# Altium project isolated-gate-driver.PrjPcb
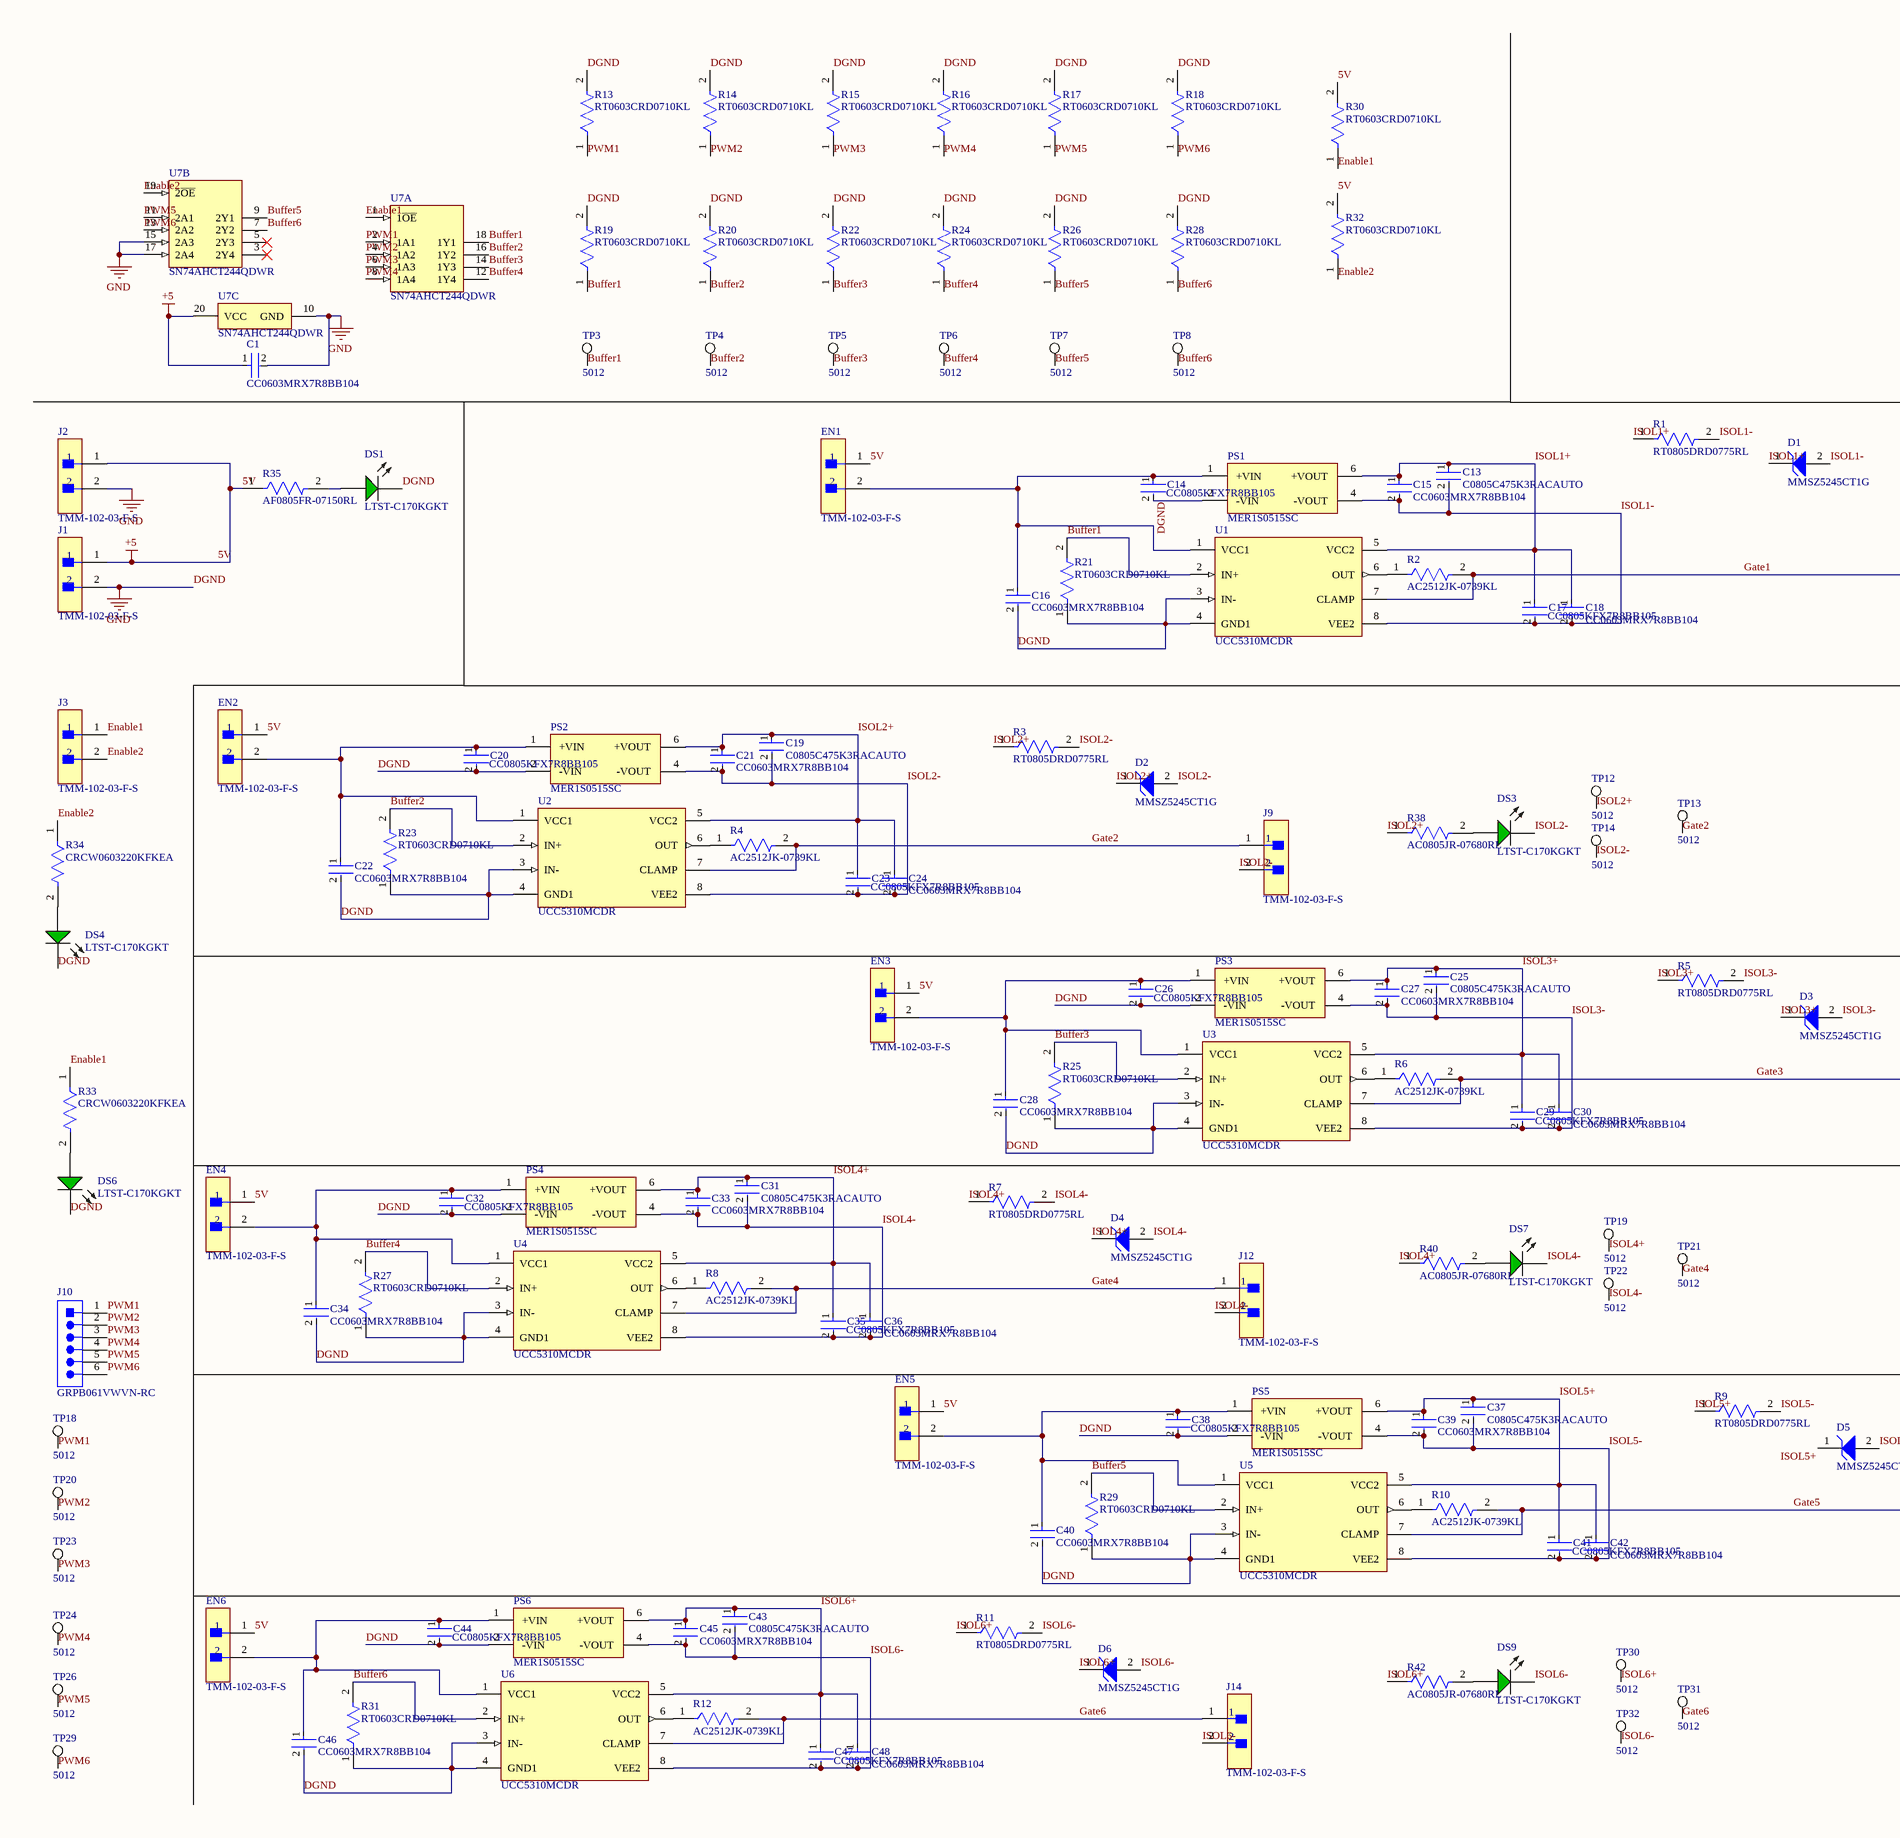
[diagram p0: Sheet2.SchDoc, left]
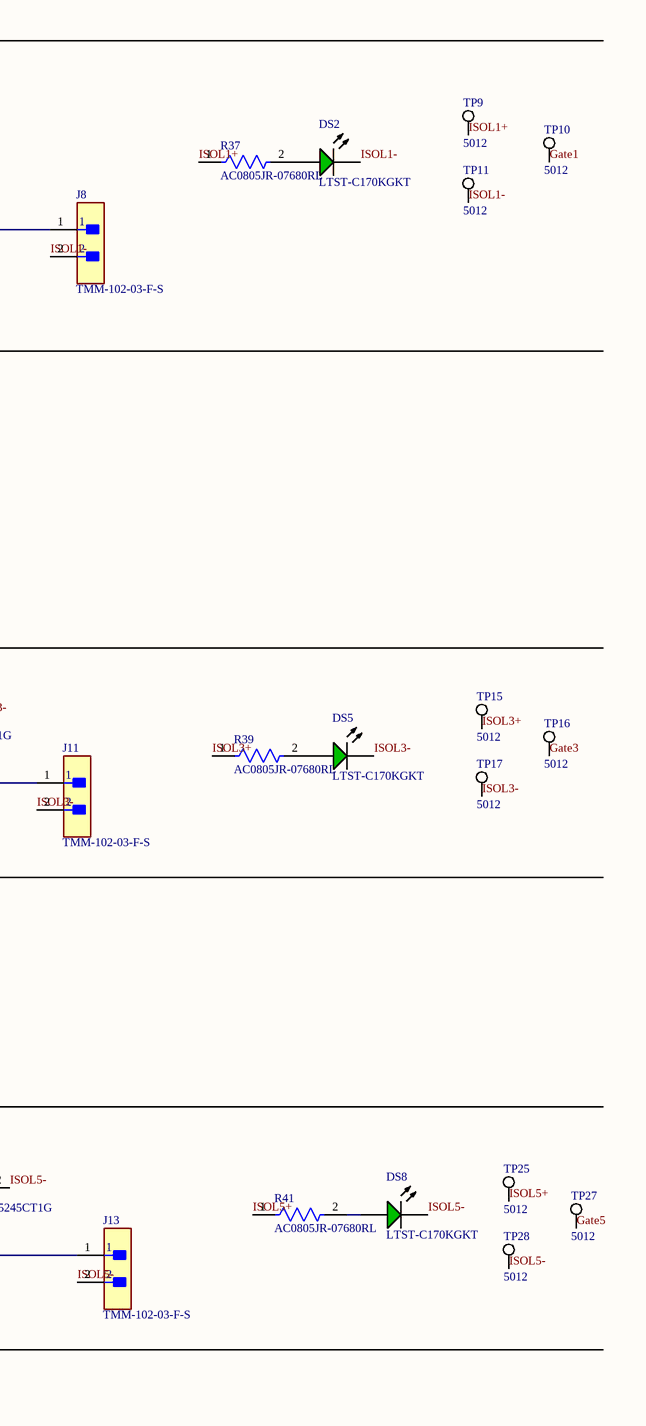
[diagram p1: Sheet2.SchDoc, right]
1 sheet, 152 parts. Net scope: global (net labels, ports and power ports of the same name join across sheets).
Board file: PCB2.PcbDoc

## Sheet Sheet2.SchDoc
size C; SheetNumber: 1; SheetTotal: 1

### Parts
C1  CC0603MRX7R8BB104  [FP-CC0603-DA-MFG]
C13  C0805C475K3RACAUTO  [FP-C0805C475K3RACAUTO-MFG]
C14  CC0805KFX7R8BB105  [FP-CC0805-0_85-MFG]
C15  CC0603MRX7R8BB104  [FP-CC0603-DA-MFG]
C16  CC0603MRX7R8BB104  [FP-CC0603-DA-MFG]
C17  CC0805KFX7R8BB105  [FP-CC0805-0_85-MFG]
C18  CC0603MRX7R8BB104  [FP-CC0603-DA-MFG]
C19  C0805C475K3RACAUTO  [FP-C0805C475K3RACAUTO-MFG]
C20  CC0805KFX7R8BB105  [FP-CC0805-0_85-MFG]
C21  CC0603MRX7R8BB104  [FP-CC0603-DA-MFG]
C22  CC0603MRX7R8BB104  [FP-CC0603-DA-MFG]
C23  CC0805KFX7R8BB105  [FP-CC0805-0_85-MFG]
C24  CC0603MRX7R8BB104  [FP-CC0603-DA-MFG]
C25  C0805C475K3RACAUTO  [FP-C0805C475K3RACAUTO-MFG]
C26  CC0805KFX7R8BB105  [FP-CC0805-0_85-MFG]
C27  CC0603MRX7R8BB104  [FP-CC0603-DA-MFG]
C28  CC0603MRX7R8BB104  [FP-CC0603-DA-MFG]
C29  CC0805KFX7R8BB105  [FP-CC0805-0_85-MFG]
C30  CC0603MRX7R8BB104  [FP-CC0603-DA-MFG]
C31  C0805C475K3RACAUTO  [FP-C0805C475K3RACAUTO-MFG]
C32  CC0805KFX7R8BB105  [FP-CC0805-0_85-MFG]
C33  CC0603MRX7R8BB104  [FP-CC0603-DA-MFG]
C34  CC0603MRX7R8BB104  [FP-CC0603-DA-MFG]
C35  CC0805KFX7R8BB105  [FP-CC0805-0_85-MFG]
C36  CC0603MRX7R8BB104  [FP-CC0603-DA-MFG]
C37  C0805C475K3RACAUTO  [FP-C0805C475K3RACAUTO-MFG]
C38  CC0805KFX7R8BB105  [FP-CC0805-0_85-MFG]
C39  CC0603MRX7R8BB104  [FP-CC0603-DA-MFG]
C40  CC0603MRX7R8BB104  [FP-CC0603-DA-MFG]
C41  CC0805KFX7R8BB105  [FP-CC0805-0_85-MFG]
C42  CC0603MRX7R8BB104  [FP-CC0603-DA-MFG]
C43  C0805C475K3RACAUTO  [FP-C0805C475K3RACAUTO-MFG]
C44  CC0805KFX7R8BB105  [FP-CC0805-0_85-MFG]
C45  CC0603MRX7R8BB104  [FP-CC0603-DA-MFG]
C46  CC0603MRX7R8BB104  [FP-CC0603-DA-MFG]
C47  CC0805KFX7R8BB105  [FP-CC0805-0_85-MFG]
C48  CC0603MRX7R8BB104  [FP-CC0603-DA-MFG]
D1  MMSZ5245CT1G  [ONSC-SOD-123-2-425-04_V]
D2  MMSZ5245CT1G  [ONSC-SOD-123-2-425-04_V]
D3  MMSZ5245CT1G  [ONSC-SOD-123-2-425-04_V]
D4  MMSZ5245CT1G  [ONSC-SOD-123-2-425-04_V]
D5  MMSZ5245CT1G  [ONSC-SOD-123-2-425-04_V]
D6  MMSZ5245CT1G  [ONSC-SOD-123-2-425-04_V]
DS1  LTST-C170KGKT  [LTST-LTST-C170KGKT-2_V]
DS2  LTST-C170KGKT  [LTST-LTST-C170KGKT-2_V]
DS3  LTST-C170KGKT  [LTST-LTST-C170KGKT-2_V]
DS4  LTST-C170KGKT  [LTST-LTST-C170KGKT-2_V]
DS5  LTST-C170KGKT  [LTST-LTST-C170KGKT-2_V]
DS6  LTST-C170KGKT  [LTST-LTST-C170KGKT-2_V]
DS7  LTST-C170KGKT  [LTST-LTST-C170KGKT-2_V]
DS8  LTST-C170KGKT  [LTST-LTST-C170KGKT-2_V]
DS9  LTST-C170KGKT  [LTST-LTST-C170KGKT-2_V]
EN1  TMM-102-03-F-S  [PinHeader_1x02_P2.54mm_Vertical]
EN2  TMM-102-03-F-S  [PinHeader_1x02_P2.54mm_Vertical]
EN3  TMM-102-03-F-S  [PinHeader_1x02_P2.54mm_Vertical]
EN4  TMM-102-03-F-S  [PinHeader_1x02_P2.54mm_Vertical]
EN5  TMM-102-03-F-S  [PinHeader_1x02_P2.54mm_Vertical]
EN6  TMM-102-03-F-S  [PinHeader_1x02_P2.54mm_Vertical]
J1  TMM-102-03-F-S  [PinHeader_1x02_P2.54mm_Vertical]
J2  TMM-102-03-F-S  [PinHeader_1x02_P2.54mm_Vertical]
J3  TMM-102-03-F-S  [PinHeader_1x02_P2.54mm_Vertical]
J8  TMM-102-03-F-S  [PinHeader_1x02_P2.54mm_Vertical]
J9  TMM-102-03-F-S  [PinHeader_1x02_P2.54mm_Vertical]
J10  GRPB061VWVN-RC  [PinHeader_1x06_P2.54mm_Vertical]
J11  TMM-102-03-F-S  [PinHeader_1x02_P2.54mm_Vertical]
J12  TMM-102-03-F-S  [PinHeader_1x02_P2.54mm_Vertical]
J13  TMM-102-03-F-S  [PinHeader_1x02_P2.54mm_Vertical]
J14  TMM-102-03-F-S  [PinHeader_1x02_P2.54mm_Vertical]
PS1  MER1S0515SC  [MER1S0515SC_MFG]
PS2  MER1S0515SC  [MER1S0515SC_MFG]
PS3  MER1S0515SC  [MER1S0515SC_MFG]
PS4  MER1S0515SC  [MER1S0515SC_MFG]
PS5  MER1S0515SC  [MER1S0515SC_MFG]
PS6  MER1S0515SC  [MER1S0515SC_MFG]
R1  RT0805DRD0775RL  [FP-RT0805-MFG]
R2  AC2512JK-0739KL  [FP-AC2512-MFG]
R3  RT0805DRD0775RL  [FP-RT0805-MFG]
R4  AC2512JK-0739KL  [FP-AC2512-MFG]
R5  RT0805DRD0775RL  [FP-RT0805-MFG]
R6  AC2512JK-0739KL  [FP-AC2512-MFG]
R7  RT0805DRD0775RL  [FP-RT0805-MFG]
R8  AC2512JK-0739KL  [FP-AC2512-MFG]
R9  RT0805DRD0775RL  [FP-RT0805-MFG]
R10  AC2512JK-0739KL  [FP-AC2512-MFG]
R11  RT0805DRD0775RL  [FP-RT0805-MFG]
R12  AC2512JK-0739KL  [FP-AC2512-MFG]
R13  RT0603CRD0710KL  [FP-RT0603-MFG]
R14  RT0603CRD0710KL  [FP-RT0603-MFG]
R15  RT0603CRD0710KL  [FP-RT0603-MFG]
R16  RT0603CRD0710KL  [FP-RT0603-MFG]
R17  RT0603CRD0710KL  [FP-RT0603-MFG]
R18  RT0603CRD0710KL  [FP-RT0603-MFG]
R19  RT0603CRD0710KL  [FP-RT0603-MFG]
R20  RT0603CRD0710KL  [FP-RT0603-MFG]
R21  RT0603CRD0710KL  [FP-RT0603-MFG]
R22  RT0603CRD0710KL  [FP-RT0603-MFG]
R23  RT0603CRD0710KL  [FP-RT0603-MFG]
R24  RT0603CRD0710KL  [FP-RT0603-MFG]
R25  RT0603CRD0710KL  [FP-RT0603-MFG]
R26  RT0603CRD0710KL  [FP-RT0603-MFG]
R27  RT0603CRD0710KL  [FP-RT0603-MFG]
R28  RT0603CRD0710KL  [FP-RT0603-MFG]
R29  RT0603CRD0710KL  [FP-RT0603-MFG]
R30  RT0603CRD0710KL  [FP-RT0603-MFG]
R31  RT0603CRD0710KL  [FP-RT0603-MFG]
R32  RT0603CRD0710KL  [FP-RT0603-MFG]
R33  CRCW0603220KFKEA  [FP-CRCW0603-e3-IPC_B]
R34  CRCW0603220KFKEA  [FP-CRCW0603-e3-IPC_B]
R35  AF0805FR-07150RL  [FP-AF0805-MFG]
R37  AC0805JR-07680RL  [FP-AC0805-MFG]
R38  AC0805JR-07680RL  [FP-AC0805-MFG]
R39  AC0805JR-07680RL  [FP-AC0805-MFG]
R40  AC0805JR-07680RL  [FP-AC0805-MFG]
R41  AC0805JR-07680RL  [FP-AC0805-MFG]
R42  AC0805JR-07680RL  [FP-AC0805-MFG]
TP3  5012  [KSTN-5012_V]
TP4  5012  [KSTN-5012_V]
TP5  5012  [KSTN-5012_V]
TP6  5012  [KSTN-5012_V]
TP7  5012  [KSTN-5012_V]
TP8  5012  [KSTN-5012_V]
TP9  5012  [KSTN-5012_V]
TP10  5012  [KSTN-5012_V]
TP11  5012  [KSTN-5012_V]
TP12  5012  [KSTN-5012_V]
TP13  5012  [KSTN-5012_V]
TP14  5012  [KSTN-5012_V]
TP15  5012  [KSTN-5012_V]
TP16  5012  [KSTN-5012_V]
TP17  5012  [KSTN-5012_V]
TP18  5012  [KSTN-5012_V]
TP19  5012  [KSTN-5012_V]
TP20  5012  [KSTN-5012_V]
TP21  5012  [KSTN-5012_V]
TP22  5012  [KSTN-5012_V]
TP23  5012  [KSTN-5012_V]
TP24  5012  [KSTN-5012_V]
TP25  5012  [KSTN-5012_V]
TP26  5012  [KSTN-5012_V]
TP27  5012  [KSTN-5012_V]
TP28  5012  [KSTN-5012_V]
TP29  5012  [KSTN-5012_V]
TP30  5012  [KSTN-5012_V]
TP31  5012  [KSTN-5012_V]
TP32  5012  [KSTN-5012_V]
U1  UCC5310MCDR  [FP-D0008B-MFG]
U2  UCC5310MCDR  [FP-D0008B-MFG]
U3  UCC5310MCDR  [FP-D0008B-MFG]
U4  UCC5310MCDR  [FP-D0008B-MFG]
U5  UCC5310MCDR  [FP-D0008B-MFG]
U6  UCC5310MCDR  [FP-D0008B-MFG]
U7  SN74AHCT244QDWR  [DW0020A_M]  (parts A,B,C of 3)

### Nets
5V: C1.1 EN1.1 EN2.1 EN3.1 EN4.1 EN5.1 EN6.1 J1.1 J2.1 R30.2 R32.2 R35.1 U7.20(VCC)  [also labelled +5]
DGND: C1.2 C14.2 C16.2 C20.2 C22.2 C26.2 C28.2 C32.2 C34.2 C38.2 C40.2 C44.2 C46.2 DS1.1(K) DS4.1(K) DS6.1(K) J1.2 J2.2 PS1.2(-VIN) PS2.2(-VIN) PS3.2(-VIN) PS4.2(-VIN) PS5.2(-VIN) PS6.2(-VIN) R13.2 R14.2 R15.2 R16.2 R17.2 R18.2 R19.2 R20.2 R21.1 R22.2 R23.1 R24.2 R25.1 R26.2 R27.1 R28.2 R29.1 R31.1 U1.3(IN-) U1.4(GND1) U2.3(IN-) U2.4(GND1) U3.3(IN-) U3.4(GND1) U4.3(IN-) U4.4(GND1) U5.3(IN-) U5.4(GND1) U6.3(IN-) U6.4(GND1) U7.10(GND) U7.15(2A3) U7.17(2A4)  [also labelled GND]
Buffer1: R19.1 R21.2 TP3.1 U1.2(IN+) U7.18(1Y1)
Buffer2: R20.1 R23.2 TP4.1 U2.2(IN+) U7.16(1Y2)
Buffer3: R22.1 R25.2 TP5.1 U3.2(IN+) U7.14(1Y3)
Buffer4: R24.1 R27.2 TP6.1 U4.2(IN+) U7.12(1Y4)
Buffer5: R26.1 R29.2 TP7.1 U5.2(IN+) U7.9(2Y1)
Buffer6: R28.1 R31.2 TP8.1 U6.2(IN+) U7.7(2Y2)
Enable1: J3.1 R30.1 R33.1 U7.1(1~{OE})
Enable2: J3.2 R32.1 R34.1 U7.19(2~{OE})
Gate1: J8.1 R2.2 TP10.1 U1.7(CLAMP)
Gate2: J9.1 R4.2 TP13.1 U2.7(CLAMP)
Gate3: J11.1 R6.2 TP16.1 U3.7(CLAMP)
Gate4: J12.1 R8.2 TP21.1 U4.7(CLAMP)
Gate5: J13.1 R10.2 TP27.1 U5.7(CLAMP)
Gate6: J14.1 R12.2 TP31.1 U6.7(CLAMP)
ISOL1+: C13.1 C15.1 C17.1 C18.1 D1.1(K) PS1.6(+VOUT) R1.1 R37.1 TP9.1 U1.5(VCC2)
ISOL1-: C13.2 C15.2 C17.2 C18.2 D1.2(A) DS2.1(K) J8.2 PS1.4(-VOUT) R1.2 TP11.1 U1.8(VEE2)
ISOL2+: C19.1 C21.1 C23.1 C24.1 D2.1(K) PS2.6(+VOUT) R3.1 R38.1 TP12.1 U2.5(VCC2)
ISOL2-: C19.2 C21.2 C23.2 C24.2 D2.2(A) DS3.1(K) J9.2 PS2.4(-VOUT) R3.2 TP14.1 U2.8(VEE2)
ISOL3+: C25.1 C27.1 C29.1 C30.1 D3.1(K) PS3.6(+VOUT) R5.1 R39.1 TP15.1 U3.5(VCC2)
ISOL3-: C25.2 C27.2 C29.2 C30.2 D3.2(A) DS5.1(K) J11.2 PS3.4(-VOUT) R5.2 TP17.1 U3.8(VEE2)
ISOL4+: C31.1 C33.1 C35.1 C36.1 D4.1(K) PS4.6(+VOUT) R7.1 R40.1 TP19.1 U4.5(VCC2)
ISOL4-: C31.2 C33.2 C35.2 C36.2 D4.2(A) DS7.1(K) J12.2 PS4.4(-VOUT) R7.2 TP22.1 U4.8(VEE2)
ISOL5+: C37.1 C39.1 C41.1 C42.1 D5.1(K) PS5.6(+VOUT) R9.1 R41.1 TP25.1 U5.5(VCC2)
ISOL5-: C37.2 C39.2 C41.2 C42.2 D5.2(A) DS8.1(K) J13.2 PS5.4(-VOUT) R9.2 TP28.1 U5.8(VEE2)
ISOL6+: C43.1 C45.1 C47.1 C48.1 D6.1(K) PS6.6(+VOUT) R11.1 R42.1 TP30.1 U6.5(VCC2)
ISOL6-: C43.2 C45.2 C47.2 C48.2 D6.2(A) DS9.1(K) J14.2 PS6.4(-VOUT) R11.2 TP32.1 U6.8(VEE2)
PWM1: J10.1 R13.1 TP18.1 U7.2(1A1)
PWM2: J10.2 R14.1 TP20.1 U7.4(1A2)
PWM3: J10.3 R15.1 TP23.1 U7.6(1A3)
PWM4: J10.4 R16.1 TP24.1 U7.8(1A4)
PWM5: J10.5 R17.1 TP26.1 U7.11(2A1)
PWM6: J10.6 R18.1 TP29.1 U7.13(2A2)
NetC14_1: C14.1 C16.1 EN1.2 PS1.1(+VIN) U1.1(VCC1)
NetC20_1: C20.1 C22.1 EN2.2 PS2.1(+VIN) U2.1(VCC1)
NetC26_1: C26.1 C28.1 EN3.2 PS3.1(+VIN) U3.1(VCC1)
NetC32_1: C32.1 C34.1 EN4.2 PS4.1(+VIN) U4.1(VCC1)
NetC38_1: C38.1 C40.1 EN5.2 PS5.1(+VIN) U5.1(VCC1)
NetC44_1: C44.1 C46.1 EN6.2 PS6.1(+VIN) U6.1(VCC1)
NetDS1_2: DS1.2(A) R35.2
NetDS2_2: DS2.2(A) R37.2
NetDS3_2: DS3.2(A) R38.2
NetDS4_2: DS4.2(A) R34.2
NetDS5_2: DS5.2(A) R39.2
NetDS6_2: DS6.2(A) R33.2
NetDS7_2: DS7.2(A) R40.2
NetDS8_2: DS8.2(A) R41.2
NetDS9_2: DS9.2(A) R42.2
NetR2_1: R2.1 U1.6(OUT)
NetR4_1: R4.1 U2.6(OUT)
NetR6_1: R6.1 U3.6(OUT)
NetR8_1: R8.1 U4.6(OUT)
NetR10_1: R10.1 U5.6(OUT)
NetR12_1: R12.1 U6.6(OUT)

Not connected (* = marked no-connect by the designer): U7 3(2Y4)* 5(2Y3)*

### Library data of the parts
C1 C15 C16 C18 C21 C22 C24 C27 C28 C30 C33 C34 C36 C39 C40 C42 C45 C46 C48 = CMP-03422-001021-1: CAP CER 0.1UF 25V X7R 0603; Manufacturer: YAGEO; Tolerance: 0.2; Value: 100 nF; Material: Ceramic; Temperature Coefficient: 15%; Digikey Description: CAP CER 0.1UF 25V X7R 0603; Voltage Rating: 25 V; Mouser Description: Multilayer Ceramic Capacitors MLCC - SMD/SMT 100nF 25V X7R 20%; Package: CC0603-DA; Device Class L1: Passive Components; Automotive: No; Manufacturer Part Number: CC0603MRX7R8BB104; Category: Cap; Height: 0.9mm; Octopart: https://octopart.com/cc0603mrx7r8bb104-yageo-12817663; Device Class L2: Capacitors; Device Class L3: Ceramic Capacitors; Temperature Range High: +125°C; Footprint Url: http://www.yageo.com/exep/pages/download/literatures/UPY-C_GEN_24.pdf; Temperature Range Low: -55°C; Temperature: -55°C to +125°C; Voltage: 25 V; Lead Free: Yes; Capacitance: 100 nF; ComponentLink2URL: http://www.yageo.com/documents/recent/UPY-GPHC_X7R_6.3V-to-50V_18.pdf; RoHS: TRUE; Temperature Characteristic: X7R; ComponentLink2Description: Datasheet
C13 C19 C25 C31 C37 C43 = CMP-03020-034682-1: CAP CER 0805 4.7UF 25V X7R  10%; RoHS Compliant: Yes
C14 C17 C20 C23 C26 C29 C32 C35 C38 C41 C44 C47 = CMP-03422-000373-1: CC0805 1 uF X7R 10.00% 25 V; Manufacturer: Yageo; Voltage Rating: 25 V; Value: 1 uF; Tolerance: 0.1; Material: Ceramic; Category: Cap; Footprint Url: http://www.yageo.com/exep/pages/download/literatures/UPY-C_GEN_24.pdf; ComponentLink2Description: Datasheet; Temperature Characteristic: X7R; Temperature Range High: +85°C; Manufacturer Part Number: CC0805KFX7R8BB105; Mouser Description: CC Series 0805 1 uF 25 V ±10% Tolerance X7R Multilayer Ceramic Capacitor; Package: CC0805-0.85; Device Class L1: Passive Components; Automotive: No; RoHS: TRUE; Octopart: https://octopart.com/cc0805kfx7r8bb105-yageo-33242303; Capacitance: 1 uF; Device Class L2: Capacitors; Ipc Land Pattern Name: CAPC200125X85; Temperature Range Low: -30°C; Temperature: -30°C to +85°C; Height: 0.95mm; ComponentLink2URL: http://www.yageo.com/documents/recent/UPY-GPHC_Y5V_6.3V-to-50V_8.pdf; Device Class L3: Ceramic Capacitors; Lead Free: Yes
D1-D6 = CMP-1060-00534-1: Zener Voltage Regulator, 500 mW, 2-Pin SOD-123, Pb-Free, Tape and Reel; Manufacturer: On Semiconductor; VZ Typ (V): 15; P Max (W): 0.5; PackageReference: SOD-123-2-425-04; ComponentLink2Description: Datasheet; PackageDescription: 2-Pin SOD, Body 1.6 x 2.69 mm; ComponentLink1URL: http://www.onsemi.com/; PartNumber: MMSZ5245CT1G; ComponentLink3URL: http://www.onsemi.com/pub_link/Collateral/425-04.PDF; ComponentLink1Description: Manufacturer URL; Packing: Tape and Reel; Mounting Technology: Surface Mount; DatasheetVersion: Rev. 12; ComponentLink2URL: http://www.onsemi.com/pub_link/Collateral/MMSZ5221BT1-D.PDF; ComponentLink3Description: Package Specification; PackageVersion: Rev. G, 10/2009; RoHS: Pb-Free
DS1-DS9 = CMP-2000-06620-1: Ultra Bright AlInGaP Chip LED, 75 mW, -55 to 85 degC, 2-Pin SMD (0805), RoHS, Tape and Reel; Manufacturer: Lite-On; Forward Current: 30mA; Power Dissipation Max: 75mW; Emitting Color: YellowGreen; Type: Uni-Color; Forward Voltage: 2.4V; Dominant Wave Length: 571nm; Test Current (It): 20mA; Product Length (mm): 2mm; Peak Wavelength: 574nm; Power Dissipation: 75W; Product Depth (mm): 1.25mm; DELETED: Compliant; High Brightness: Yes; Product Height (mm): 1.1mm; Luminous Intensity: 35mcd; Shape Type: Rectangular; Chip Material: AlGaInP; Viewing Angle: 130deg; Number of  Elements: 1; Reverse Voltage: 5V; Rad Hardened: No; Package Type: ChipLed; Manufacturer URL: http://www.us.liteon.com/; Mounting: SurfaceMount; Operating Temp Range: -55Cto85C; Datasheet URL: http://optoelectronics.liteon.com/upload/download/DS22-2000-073/S_110_LTST-C170KGKT.pdf; Packaging: TapeandReel; Pin Count: 2; Package Description: 2-Pin Surface Mounted Device, Body 2 x 1.25 mm; Mounting Technology: SurfaceMount; Package Reference: LTST-C170KGKT-2; Forward Current Max: 30mA; Datasheet Version: Rev. G, 06/2005; Lens Dimensions: 1.4x1.25x0.6mm; Operating Temperature Classification: Industrial; Lum Intensity: 35mcd; Main Category: ChipLED
EN1-EN6 J1-J3 J8 J9 J11-J14 = CMP-02766-001614-1: CONN HEADER VERT 2POS 2MM; Number of Contacts: 2; Gender: Male; Pitch: 2mm; Packaging: Bulk; RoHS Compliant: Yes; Termination: Solder; Contact Plating: Gold; Mount: Through Hole; Number of Rows: 1; Radiation Hardening: No; Lead Free: Lead Free
  EN1-EN6 J1-J3: Component Type: Source
J10 = CMP-2000-06374-1: Male Header, Pitch 1.27 mm, 1 x 6 Position, Height 4 mm, Tail Length 2.3 mm, -40 to 105 degC, RoHS, Bulk; Manufacturer: Sullins; Other Names: S9014E-06; Number of Positions Loaded: All; Pitch: 0.050"(1.27mm); Connector Type: Header,Unshrouded; Mating Products: S9010E-06-ND / -CONNHEADER.050"6POSR/APCB / S9008E-06-ND / -CONNHEADER.050"6POSPCBGOLD / S9005E-06-ND / -CONNHEADER.050"6POSSMDGOLD; Dynamic Catalog: GRPB; Number of Positions: 6; Catalog Drawings: S9014ESeriesTop; Family: RectangularConnectors-Headers,MalePins; Contact Mating Length: 0.118"(3.00mm); Termination: Solder; Contact Finish: Gold; Manufacturer URL: http://www.sullinscorp.com/; Category: Connectors,Interconnects; Package Description: Male Header, Pitch 1.27 mm, 1 x 6 Position, Height 4 mm, Tail Length 2.3 mm; Standard Package: 1; Packaging: Bulk; Datasheet Version: Rev. C, 12/2008; Contact Type: MalePin; Number of Rows: 1; Package Reference: GRPB061VWVN-RC; Mounting Technology: ThroughHole; Contact Finish Thickness: Flash; Datasheet URL: http://www.sullinscorp.com/drawings/71_GRPB___1VWVN-RC,_10957-C.pdf; Mounting Type: ThroughHole
PS1-PS6 = CMP-09306-49448123-1: Module DC-DC 5VIN 1-OUT 15V 0.067A 1W 4-Pin SIP Tube; Nominal Input Voltage: 5V; Isolation: Isolated; Min Input Voltage: 4.5V; Efficiency: 87.5%; Number of Outputs: 1; Current - Output 1: 67mA; Max Input Voltage (DC): 5.5V; Isolation Voltage: 1kV; Radiation Hardening: No; Max Power Dissipation: 1W; ComponentLink2URL: https://www.murata.com/products/productdata/8807029833758/kdc-mer1.pdf?1706585426000; Output Power: 1W; Nominal Output Voltage: 15V; Output Current: 67mA; Voltage - Output 1: 15V; Length: 19.65mm; ComponentLink2Description: Datasheet URL; REACH SVHC: No; Max Input Voltage: 5.5V; Case/Package: SIP; Mount: Through Hole; Max Output Current: 67mA; Min Operating Temperature: -40°C; Min Input Voltage (DC): 4.5V; Max Output Power: 1W; Power Rating: 1W; Number of Pins: 4; HelpURL: https://www.murata.com/products/productdata/8807029833758/kdc-mer1.pdf?1706585426000; Output Voltage: 15V; RoHS: Compliant; Depth: 6.15mm; Max Operating Temperature: 85°C; Lead Free: Lead Free
R1 R3 R5 R7 R9 R11 = CMP-03412-013473-1: RES SMD 75 OHM 0.5% 1/8W 0805; Manufacturer: Yageo; Power Rating: 0.125W; Tolerance: 0.01; Resistance: 75Ω; Temperature Coefficient: 25 ppm/°C; Value: 75Ω; Voltage Rating: 150V; Series: RT; Composition: Thin Film; Temperature: -55°C to +155°C; Manufacturer Part Number: RT0805DRD0775RL; Footprint Url: http://www.yageo.com/exep/pages/download/literatures/PYu-R_Mount_10.pdf; ComponentLink2URL: http://www.yageo.com/documents/recent/PYu-RT_1-to-0.01_RoHS_L_9.pdf; Device Class L1: Passive Components; Height: 0.6mm; Automotive: No; RoHS: TRUE; Digikey Description: RES SMD 75 OHM 0.5% 1/8W 0805; Device Class L3: Chip SMD Resistors; Lead Free: Yes; ComponentLink2Description: Datasheet; Ipc Land Pattern Name: RESC200125X50; Package: RT0805; Category: Res; Temperature Range Low: -55°C; Temperature Range High: +155°C; Octopart: https://octopart.com/rt0805drd0775rl-yageo-1390155; Device Class L2: Resistors
R2 R4 R6 R8 R10 R12 = CMP-03412-022310-1: RES SMD 39K OHM 5% 1W 2512; Manufacturer: Yageo; Automotive Grade: Grade 0; Value: 39KΩ; Tolerance: 0.05; Voltage Rating: 200V; Temperature Range High: +155°C; ComponentLink2URL: http://www.yageo.com/documents/recent/PYu-AC_51_RoHS_L_6.pdf; Power Rating: 1W; Device Class L3: Chip SMD Resistors; Composition: Thick Film; Digikey Description: RES SMD 39K OHM 5% 1W 2512; Octopart: https://octopart.com/ac2512jk-0739kl-yageo-71370377; Device Class L2: Resistors; Manufacturer Part Number: AC2512JK-0739KL; Lead Free: Yes; Package: AC2512; Automotive: Yes; Category: Res; Footprint Url: http://www.yageo.com/exep/pages/download/literatures/PYu-R_Mount_10.pdf; Height: 0.65mm; Series: AC; RoHS: TRUE; Ipc Land Pattern Name: RESC635310X55; ComponentLink2Description: Datasheet; Resistance: 39KΩ; Temperature Range Low: -55°C; Device Class L1: Passive Components; Temperature: -55°C to +155°C
R13-R32 = CMP-03412-020008-1: RES SMD 10K OHM 0.25% 1/10W 0603; Manufacturer: Yageo; Value: 10KΩ; Tolerance: 0.0025; Temperature Coefficient: 25 ppm/°C; Voltage Rating: 75V; Power Rating: 0.1W; ComponentLink2Description: Datasheet; Composition: Thin Film; Temperature: -55°C to +155°C; Temperature Range Low: -55°C; Temperature Range High: +155°C; Device Class L1: Passive Components; Manufacturer Part Number: RT0603CRD0710KL; Device Class L3: Chip SMD Resistors; Height: 0.55mm; Resistance: 10KΩ; Category: Res; Device Class L2: Resistors; Footprint Url: http://www.yageo.com/exep/pages/download/literatures/PYu-R_Mount_10.pdf; ComponentLink2URL: http://www.yageo.com/documents/recent/PYu-RT_1-to-0.01_RoHS_L_9.pdf; Ipc Land Pattern Name: RESC16080X45; Digikey Description: RES SMD 10K OHM 0.25% 1/10W 0603; Mouser Description: Thin Film Resistors 1/10W 10K ohm .25% 25ppm; Lead Free: Yes; Series: RT; Octopart: https://octopart.com/rt0603crd0710kl-yageo-1262801; Package: RT0603; RoHS: TRUE; Automotive: No
R33 R34 = CMP-1666-00032-2: RES Thick Film, 220kΩ, 1%, 0.1W, 100ppm/°C, 0603; Resistance: 220kR; Max Power Dissipation: 100mW; Voltage Rating (DC): 75V; Width: 0.85mm; Packaging: Tape and Reel; Length: 1.55mm; Max Operating Temperature: 155°C; Radiation Hardening: No; Case Code (Metric): 1608; Contact Plating: Tin; Package Quantity: 10; Features: Automotive AEC-Q200; Weight: 7.1E-05oz; Termination: SMD/SMT; Military Standard: Not; Tolerance: 1%; Lead Free: Lead Free; Height: 0.45mm; Power Rating: 100mW; Number of Terminations: 2; Min Operating Temperature: -55°C; Case/Package: 0603; Voltage Rating: 75V; Temperature Coefficient: 100ppm/°C; Composition: Thick Film; Case Code (Imperial): 0603; Depth: 0.85mm
R35 = CMP-03412-047726-1: Anti-Sulfurated Chip Resistor Automotive Grade 150Ω 1% 0.125W ±100ppm/°C 0805; Resistance: 150R; Max Power Dissipation: 125mW; Height: 0.024inch; Features: Moisture Resistant; RoHS Compliant: Yes; Temperature Coefficient: 100ppm/°C; Tolerance: 1%; Series: AF; Width: 0.049inch; Max Operating Temperature: 155°C; Number of Terminations: 2; Case/Package: 0805; Min Operating Temperature: -55°C; Resistor Type: Thick Film; Packaging: Tape and Reel; Length: 0.079inch
R37-R42 = CMP-2001-04475-2: RES SMD 680 OHM 5% 1/8W 0805; Manufacturer: Yageo; Voltage Rating: 150V; Tolerance: 0.05; Resistance: 680Ω; Value: 680Ω; Automotive Grade: Grade 0; Mouser Description: Thick Film Resistors - SMD 1/8W 680ohm 5% AEC-Q200; Ipc Land Pattern Name: RESC200125X50; ComponentLink2Description: Datasheet; Power Rating: 1/8W; Automotive: Yes; Device Class L3: Chip SMD Resistors; Device Class L1: Passive Components; Series: AC; RoHS: TRUE; Temperature: -55°C to +155°C; Composition: Thick Film; ComponentLink2URL: http://www.yageo.com/documents/recent/PYu-AC_51_RoHS_L_6.pdf; Digikey Description: RES SMD 680 OHM 5% 1/8W 0805; Footprint Url: http://www.yageo.com/exep/pages/download/literatures/PYu-R_Mount_10.pdf; Height: 0.6mm; Temperature Range Low: -55°C; Package: AC0805; Category: Res; Manufacturer Part Number: AC0805JR-07680RL; Octopart: https://octopart.com/ac0805jr-07680rl-yageo-26185516; Device Class L2: Resistors; Temperature Range High: +155°C; Lead Free: Yes
TP3-TP32 = CMP-1672-00004-4: Test Point, White, Through Hole, RoHS, Bulk; Manufacturer: Keystone; DatasheetVersion: Rev. F, 12/2013; ComponentLink1URL: http://www.keyelco.com/; PackageReference: 5012; RoHSCompliant: true; ComponentLink2Description: Datasheet; Colour: White; Contact Material: Bronze; PackageDescription: 1-Pin Through Hole Device, Dia 3.17 mm; Mounting Technology: Through Hole; Mount: Through Hole; Package Quantity: 100; ComponentLink1Description: Manufacturer URL; Pins: 1; Height: 8.12 mm; Packaging: Bulk; REACH SVHC: No SVHC; Contact Plating: Silver; Length: 11.3 mm; ComponentLink2URL: http://www.keyelco.com/product-pdf.cfm?p=1321
U1-U6 = CMP-04912-000034-1: DGTL ISO 3KV 1CH GATE DRVR 8SOIC; Working Voltage: 990V; High Level Output Current: 1.1A; Propagation Delay: 75ns; Number of Channels: 1; Approvals: CSA; Max Output Current: 4.3A; Low Level Output Current: 2.4A; Pulse Width Distortion (PWD): 20ns; Case/Package: SOIC; Max Operating Temperature: 125°C; Min Operating Temperature: -40°C; Packaging: Cut Tape; Mount: Surface Mount; Number of Pins: 8; RoHS Compliant: Yes
U7 = CMP-0440-00679-3: Automotive Catalog Octal Buffers/Drivers With 3-State Outputs, DW0020A, LARGE T&R; Manufacturer: Texas Instruments; Bits(#): 8; Output Type: CMOS; tpd @ Nom Voltage(Max)(ns): 9.5; VCC(Min)(V): 4.5; Input Type: TTL; Voltage(Nom)(V): 5; F @ Nom Voltage(Max)(Mhz): 110; ICC @ Nom Voltage(Max)(mA): 0.04; VCC(Max)(V): 5.5; Operating Temperature Range(C): -40 to 125; Generic Part Number: SN74AHCT244Q; PackageVersion: http://www.ti.com/lit/ml/mpds173a/mpds173a.pdf; Rating: Catalog; PackageReference: DW0020A; DatasheetVersion: SGDS024; Code_JEDEC: MS-013